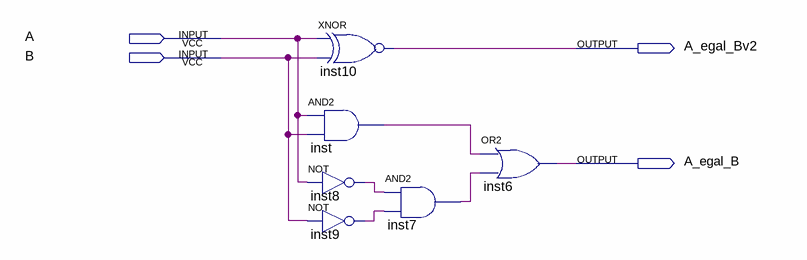
[diagram p0: schematic sheet]
// Quartus schematic comparator_1BIT.bdf as structural Verilog: 6 symbols, 4 pins
module comparator_1BIT (
  input  A,
  input  B,
  output A_egal_Bv2,
  output A_egal_B
);

  wire inst7_out, inst8_out, inst9_out, inst_out;

  xnor inst10 (A_egal_Bv2, A, B);
  and inst (inst_out, A, B);
  not inst8 (inst8_out, A);
  not inst9 (inst9_out, B);
  and inst7 (inst7_out, inst8_out, inst9_out);
  or inst6 (A_egal_B, inst_out, inst7_out);
endmodule
